# Altium schematic sheet Schematic.SchDoc: IoT Smart Pillbox
size A; CheckedBy: Thuan Nguyen; Author: Thuan Nguyen; CompanyName: Ho Chi Minh University of Technology; DrawnBy: Thuan Nguyen; Address1: 1.0; Address2: 1; SheetNumber: 1; SheetTotal: 1
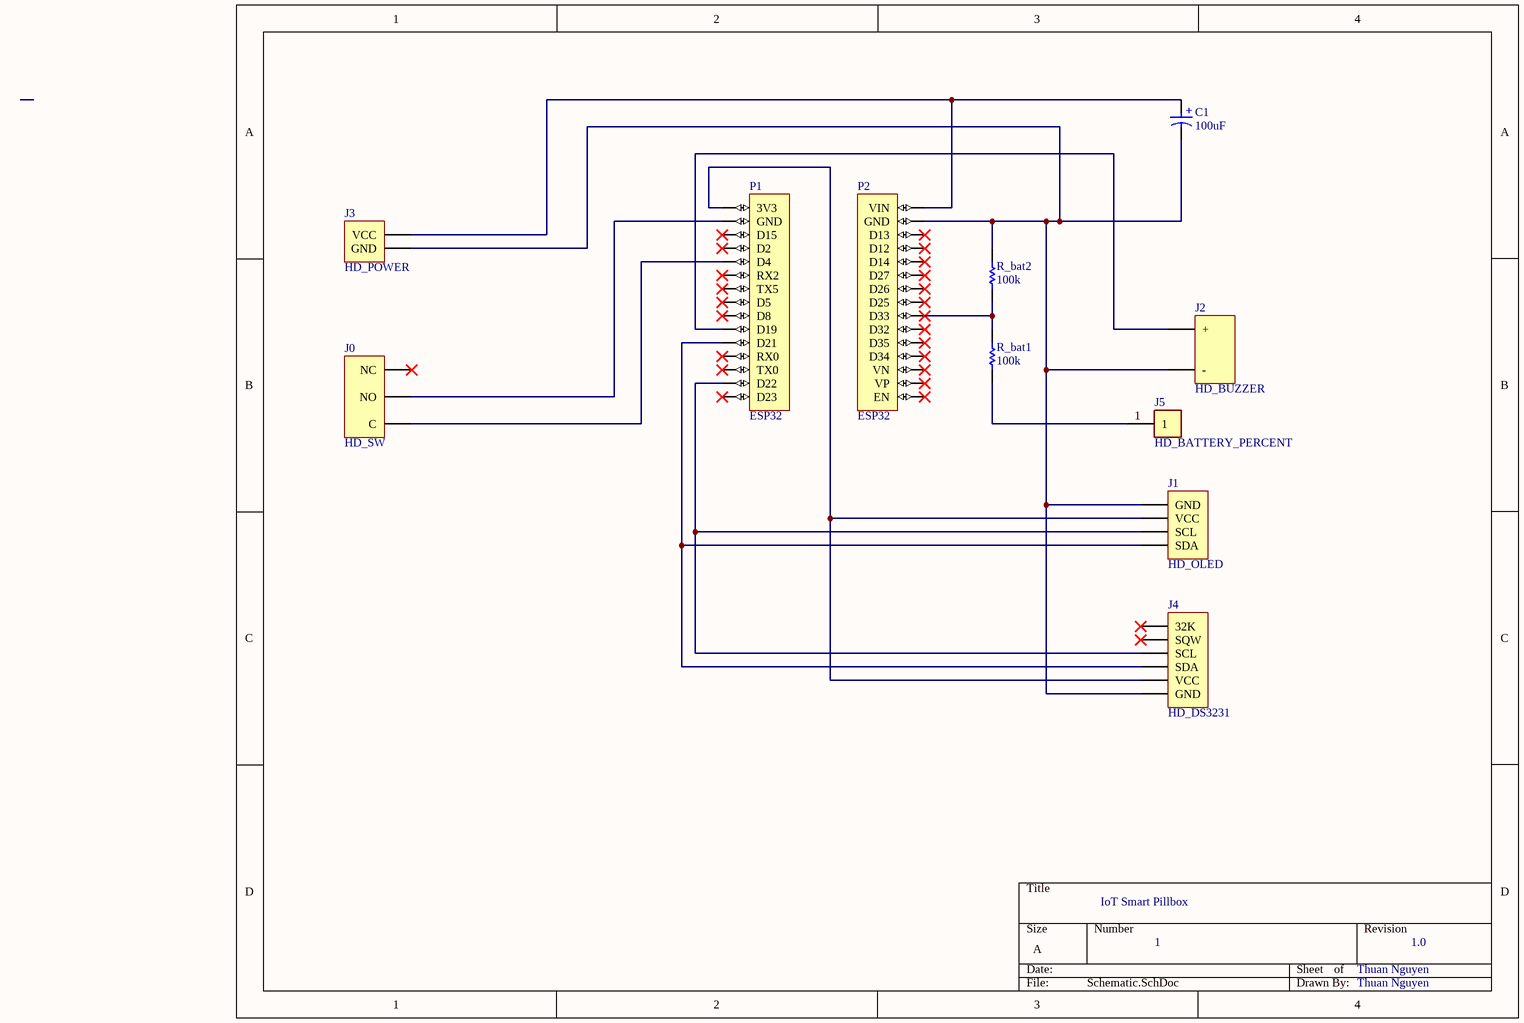
[diagram p0: Schematic.SchDoc]

## Parts
C1  100uF  [WCAP-ATLI_D6.3H11]
J0  HD_SW  [HDR1X5]
J1  HD_OLED  [HDR1X4]
J2  HD_BUZZER  [HDR1X4]
J3  HD_POWER  [HDR1X2]
J4  HD_DS3231  [HDR1X6]
J5  HD_BATTERY_PERCENT  [FP-5000-MFG]
P1  ESP32  [HDR1X15]
P2  ESP32  [HDR1X15]
R_bat1  100k  [RESA60-630X240]
R_bat2  100k  [RESA60-630X240]

## Nets
NetC1_1: C1.1(P) J3.1(VCC) P2.15(VIN)
NetC1_2: C1.2(N) J1.1(GND) J2.4(-) J3.2(GND) J4.6(GND) P2.14(GND) R_bat2.2
NetJ0_3: J0.3(NO) P1.2(GND)
NetJ0_5: J0.5(C) P1.5(D4)
NetJ1_2: J1.2(VCC) J4.5(VCC) P1.1(3V3)
NetJ1_3: J1.3(SCL) J4.3(SCL) P1.14(D22)
NetJ1_4: J1.4(SDA) J4.4(SDA) P1.11(D21)
NetJ2_1: J2.1(+) P1.10(D19)
NetJ5_1: J5.1 R_bat1.1
NetP2_7: P2.7(D33) R_bat1.2 R_bat2.1

Not connected (* = marked no-connect by the designer): J0 1(NC)* ?1(2) ?2(4); J2 2 3; J4 1(32K)* 2(SQW)*; P1 3(D15)* 4(D2)* 6(RX2)* 7(TX5)* 8(D5)* 9(D8)* 12(RX0)* 13(TX0)* 15(D23)*; P2 1(EN)* 2(VP)* 3(VN)* 4(D34)* 5(D35)* 6(D32)* 8(D25)* 9(D26)* 10(D27)* 11(D14)* 12(D12)* 13(D13)*

## Notes on the sheet
- (in symbol CMP-03913-53914350-1) +

## Library data of the parts
C1 = CMP-03913-53914350-1: 860080373005 WCAP-ATLI Aluminum Electrolytic Capacitors; Pitch: 2.5mm; Material: Aluminium; Tolerance: 20%; Capacitance: 100µF; Ripple Current: 360mA; Life (Hours): 2000hours; Polarity: Polar; Voltage Rating: 16V; Impedance: 250mΩ; Leakage Current: 16µA; RoHS: Compliant; Max Operating Temperature: 105°C; Diameter: 6.3mm; Length: 11mm; Height - Seated (Max): 12.4968mm; Mount: Through Hole; NexarPartId: 53914350; Lead Pitch: 2.4892mm; Min Operating Temperature: -55°C; Height: 11mm; Case/Package: Radial; Packaging: Tape & Box (TB)
J0 = Header 5: Header, 5-Pin; LatestRevisionDate: 17-Jul-2002; LatestRevisionNote: Re-released for DXP Platform.; Publisher: Altium Limited
J1 J2 = Header 4: Header, 4-Pin; LatestRevisionDate: 17-Jul-2002; LatestRevisionNote: Re-released for DXP Platform.; Publisher: Altium Limited
J3 = Header 2: Header, 2-Pin; LatestRevisionDate: 17-Jul-2002; LatestRevisionNote: Re-released for DXP Platform.; Publisher: Altium Limited
J4 = Header 6: Header, 6-Pin; LatestRevisionDate: 17-Jul-2002; LatestRevisionNote: Re-released for DXP Platform.; Publisher: Altium Limited
J5 = CMP-19636-000027-1: PC TEST POINT MINIATURE RED; Outside Diameter: 2.54mm; Body Material: Bronze; Number of Contacts: 1; Insulation: Insulated; Inside Diameter: 1.27mm; Hole Diameter: 1.6mm; Plating: Silver; Length: 7.62mm; Package Quantity: 100; Number of Ports: 1; Contact Material: Bronze; Orientation: Straight; RoHS Compliant: Yes; Housing Color: Red; Height: 0.3inch; Series: THM; Lead Free: Lead Free; Color: Red; Contact Plating: Tin; Mount: PCB; Packaging: Bulk; REACH SVHC: No SVHC; Flammability Rating: UL94 V-0; Material: Nylon
P1 P2 = Header 15: Header, 15-Pin; LatestRevisionDate: 17-Jul-2002; LatestRevisionNote: Re-released for DXP Platform.; Publisher: Altium Limited
R_bat1 R_bat2 = CMP-1659-00073-1: Axial Resistor, 100 KOhm, +/- 1%, 0.25 W, -55 to 155 degC, 2-Pin THD, RoHS, Bulk; Voltage Rating: 250 V; Power Rating: 250 mW; Resistance: 475 Ohm; PackageDescription: 2-Pin Axial Lead, Dia 2.4 mm, Body Length 6.3 mm; PackageReference: MFR-25; Length: 0.248 inch; ComponentLink2Description: Datasheet; Packaging: Bulk; DatasheetVersion: Apr-13; Package Quantity: 200; Min Operating Temperature: -55 degC; ComponentLink2URL: http://www.yageo.com/documents/recent/Yageo%20LR_MFR_2013.pdf; RoHSCompliant: true; ComponentLink1URL: http://www.yageo.com/; Tolerance: 1%; Case\Package: Axial; Mount: Through Hole; ComponentLink1Description: Manufacturer URL; Max Operating Temperature: 155 degC